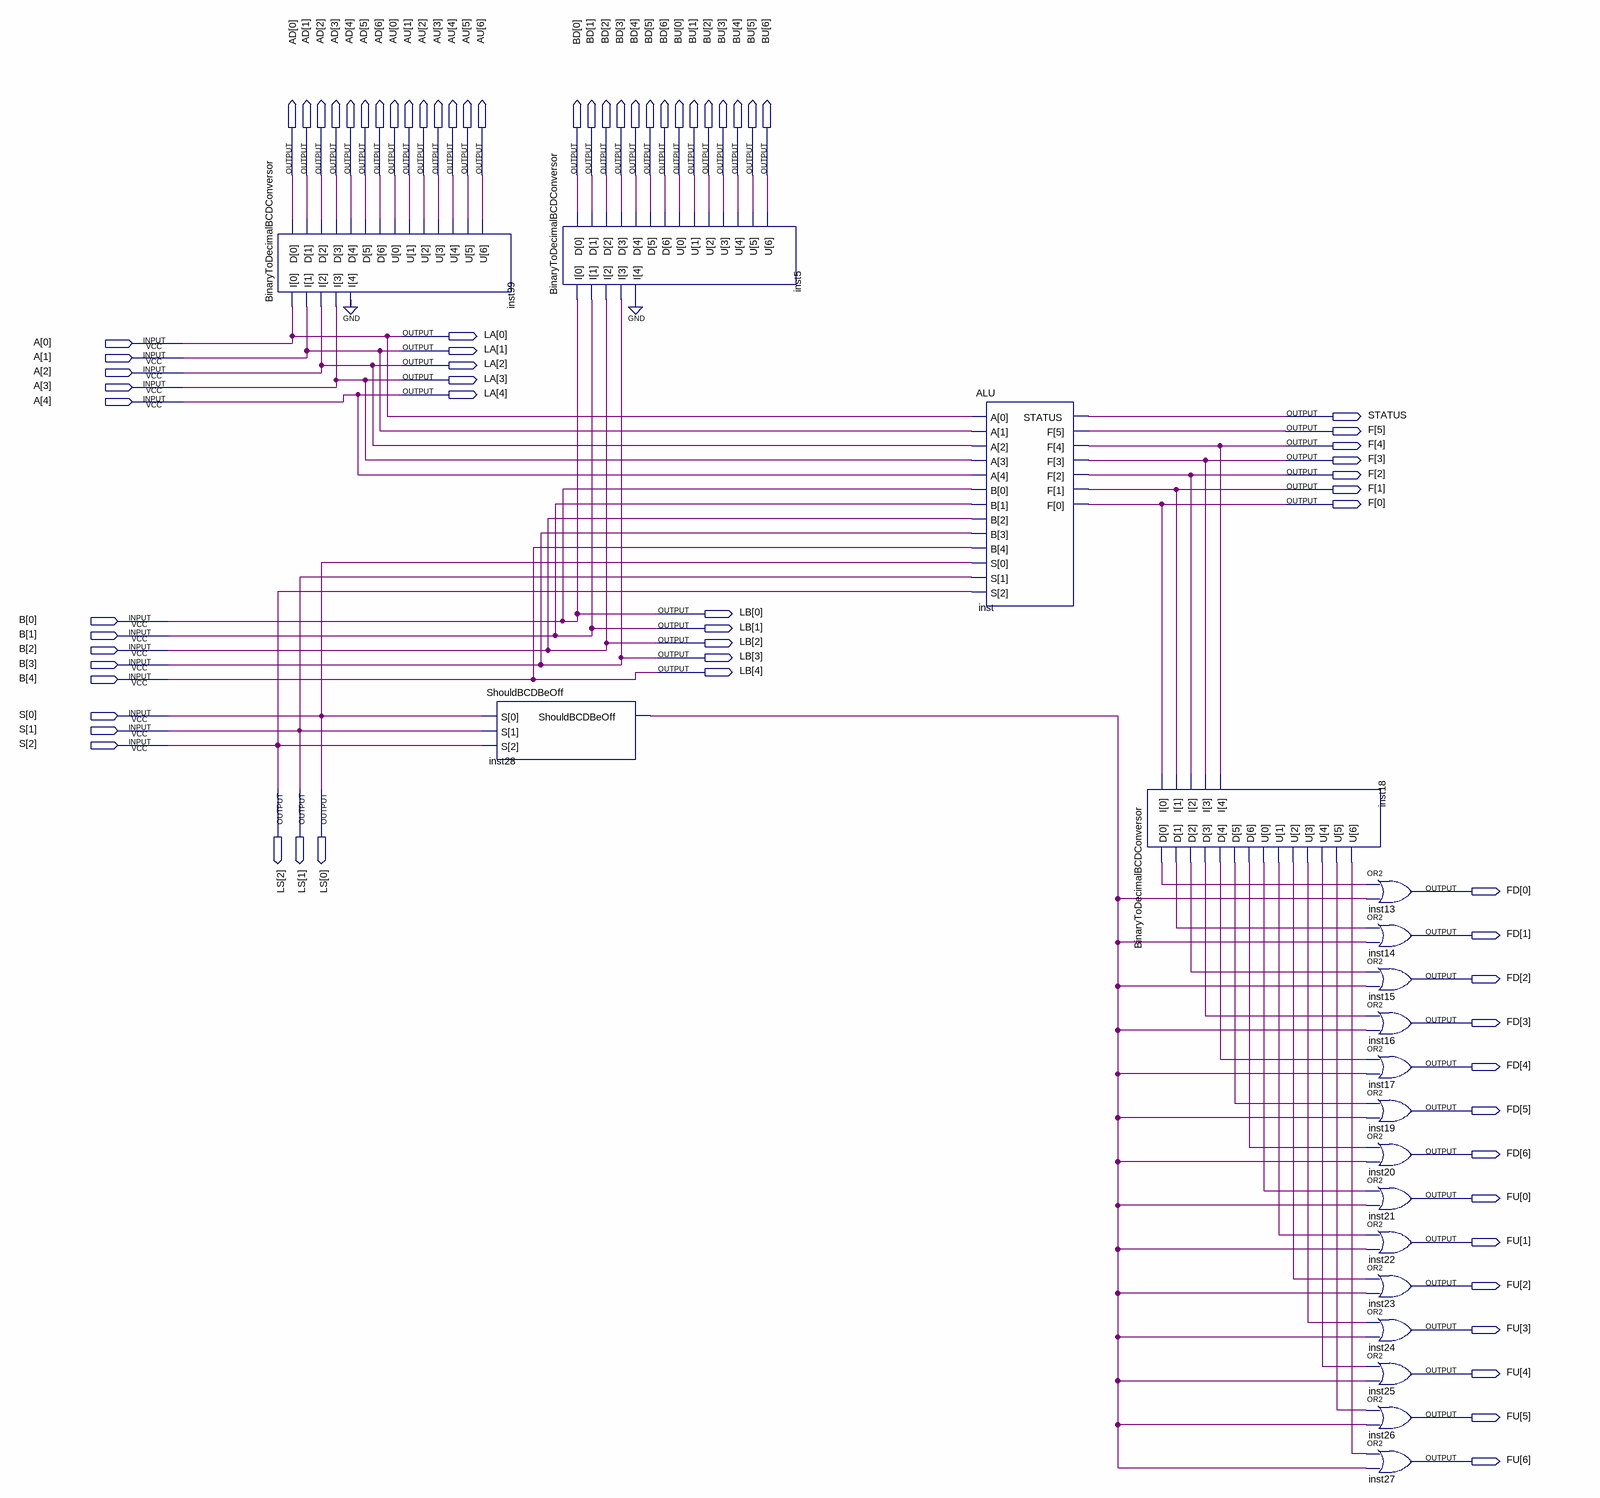
[diagram p0: schematic sheet]
// Quartus schematic Central.bdf as structural Verilog: 19 symbols, 75 pins
module Central (
  input  [4:0] A,
  input  [4:0] B,
  input  [2:0] S,
  output [6:0] AD,
  output [6:0] AU,
  output [6:0] BD,
  output [6:0] BU,
  output [4:0] LA,
  output STATUS,
  output [5:0] F,
  output [4:0] LB,
  output [2:0] LS,
  output [6:0] FD,
  output [6:0] FU
);

  wire inst18_d, inst18_d_2, inst18_d_3, inst18_d_4, inst18_d_5, inst18_d_6, inst18_d_7, inst18_u,
       inst18_u_2, inst18_u_3, inst18_u_4, inst18_u_5, inst18_u_6, inst18_u_7, inst28_shouldbcdbeoff;

  BinaryToDecimalBCDConversor inst99 (.I({1'b0, A[3:0]}), .D(AD), .U(AU));
  ShouldBCDBeOff inst28 (.S(S), .ShouldBCDBeOff(inst28_shouldbcdbeoff));
  BinaryToDecimalBCDConversor inst5 (.I({1'b0, B[3:0]}), .D(BD), .U(BU));
  ALU inst (.A(A), .B(B), .S(S), .STATUS(STATUS), .F(F));
  BinaryToDecimalBCDConversor inst18 (
    .I(F[4:0]), .D({inst18_d_7, inst18_d_6, inst18_d_5, inst18_d_4, inst18_d_3, inst18_d_2, inst18_d}),
    .U({inst18_u_7, inst18_u_6, inst18_u_5, inst18_u_4, inst18_u_3, inst18_u_2, inst18_u}));
  or inst13 (FD[0], inst18_d, inst28_shouldbcdbeoff);
  or inst14 (FD[1], inst18_d_2, inst28_shouldbcdbeoff);
  or inst15 (FD[2], inst18_d_3, inst28_shouldbcdbeoff);
  or inst16 (FD[3], inst18_d_4, inst28_shouldbcdbeoff);
  or inst17 (FD[4], inst18_d_5, inst28_shouldbcdbeoff);
  or inst19 (FD[5], inst18_d_6, inst28_shouldbcdbeoff);
  or inst20 (FD[6], inst18_d_7, inst28_shouldbcdbeoff);
  or inst21 (FU[0], inst18_u, inst28_shouldbcdbeoff);
  or inst22 (FU[1], inst18_u_2, inst28_shouldbcdbeoff);
  or inst23 (FU[2], inst18_u_3, inst28_shouldbcdbeoff);
  or inst24 (FU[3], inst18_u_4, inst28_shouldbcdbeoff);
  or inst25 (FU[4], inst18_u_5, inst28_shouldbcdbeoff);
  or inst26 (FU[5], inst18_u_6, inst28_shouldbcdbeoff);
  or inst27 (FU[6], inst18_u_7, inst28_shouldbcdbeoff);

  assign LA = A;
  assign LB = B;
  assign LS = S;
endmodule
